# Altium project LM-002-D.PrjPcb
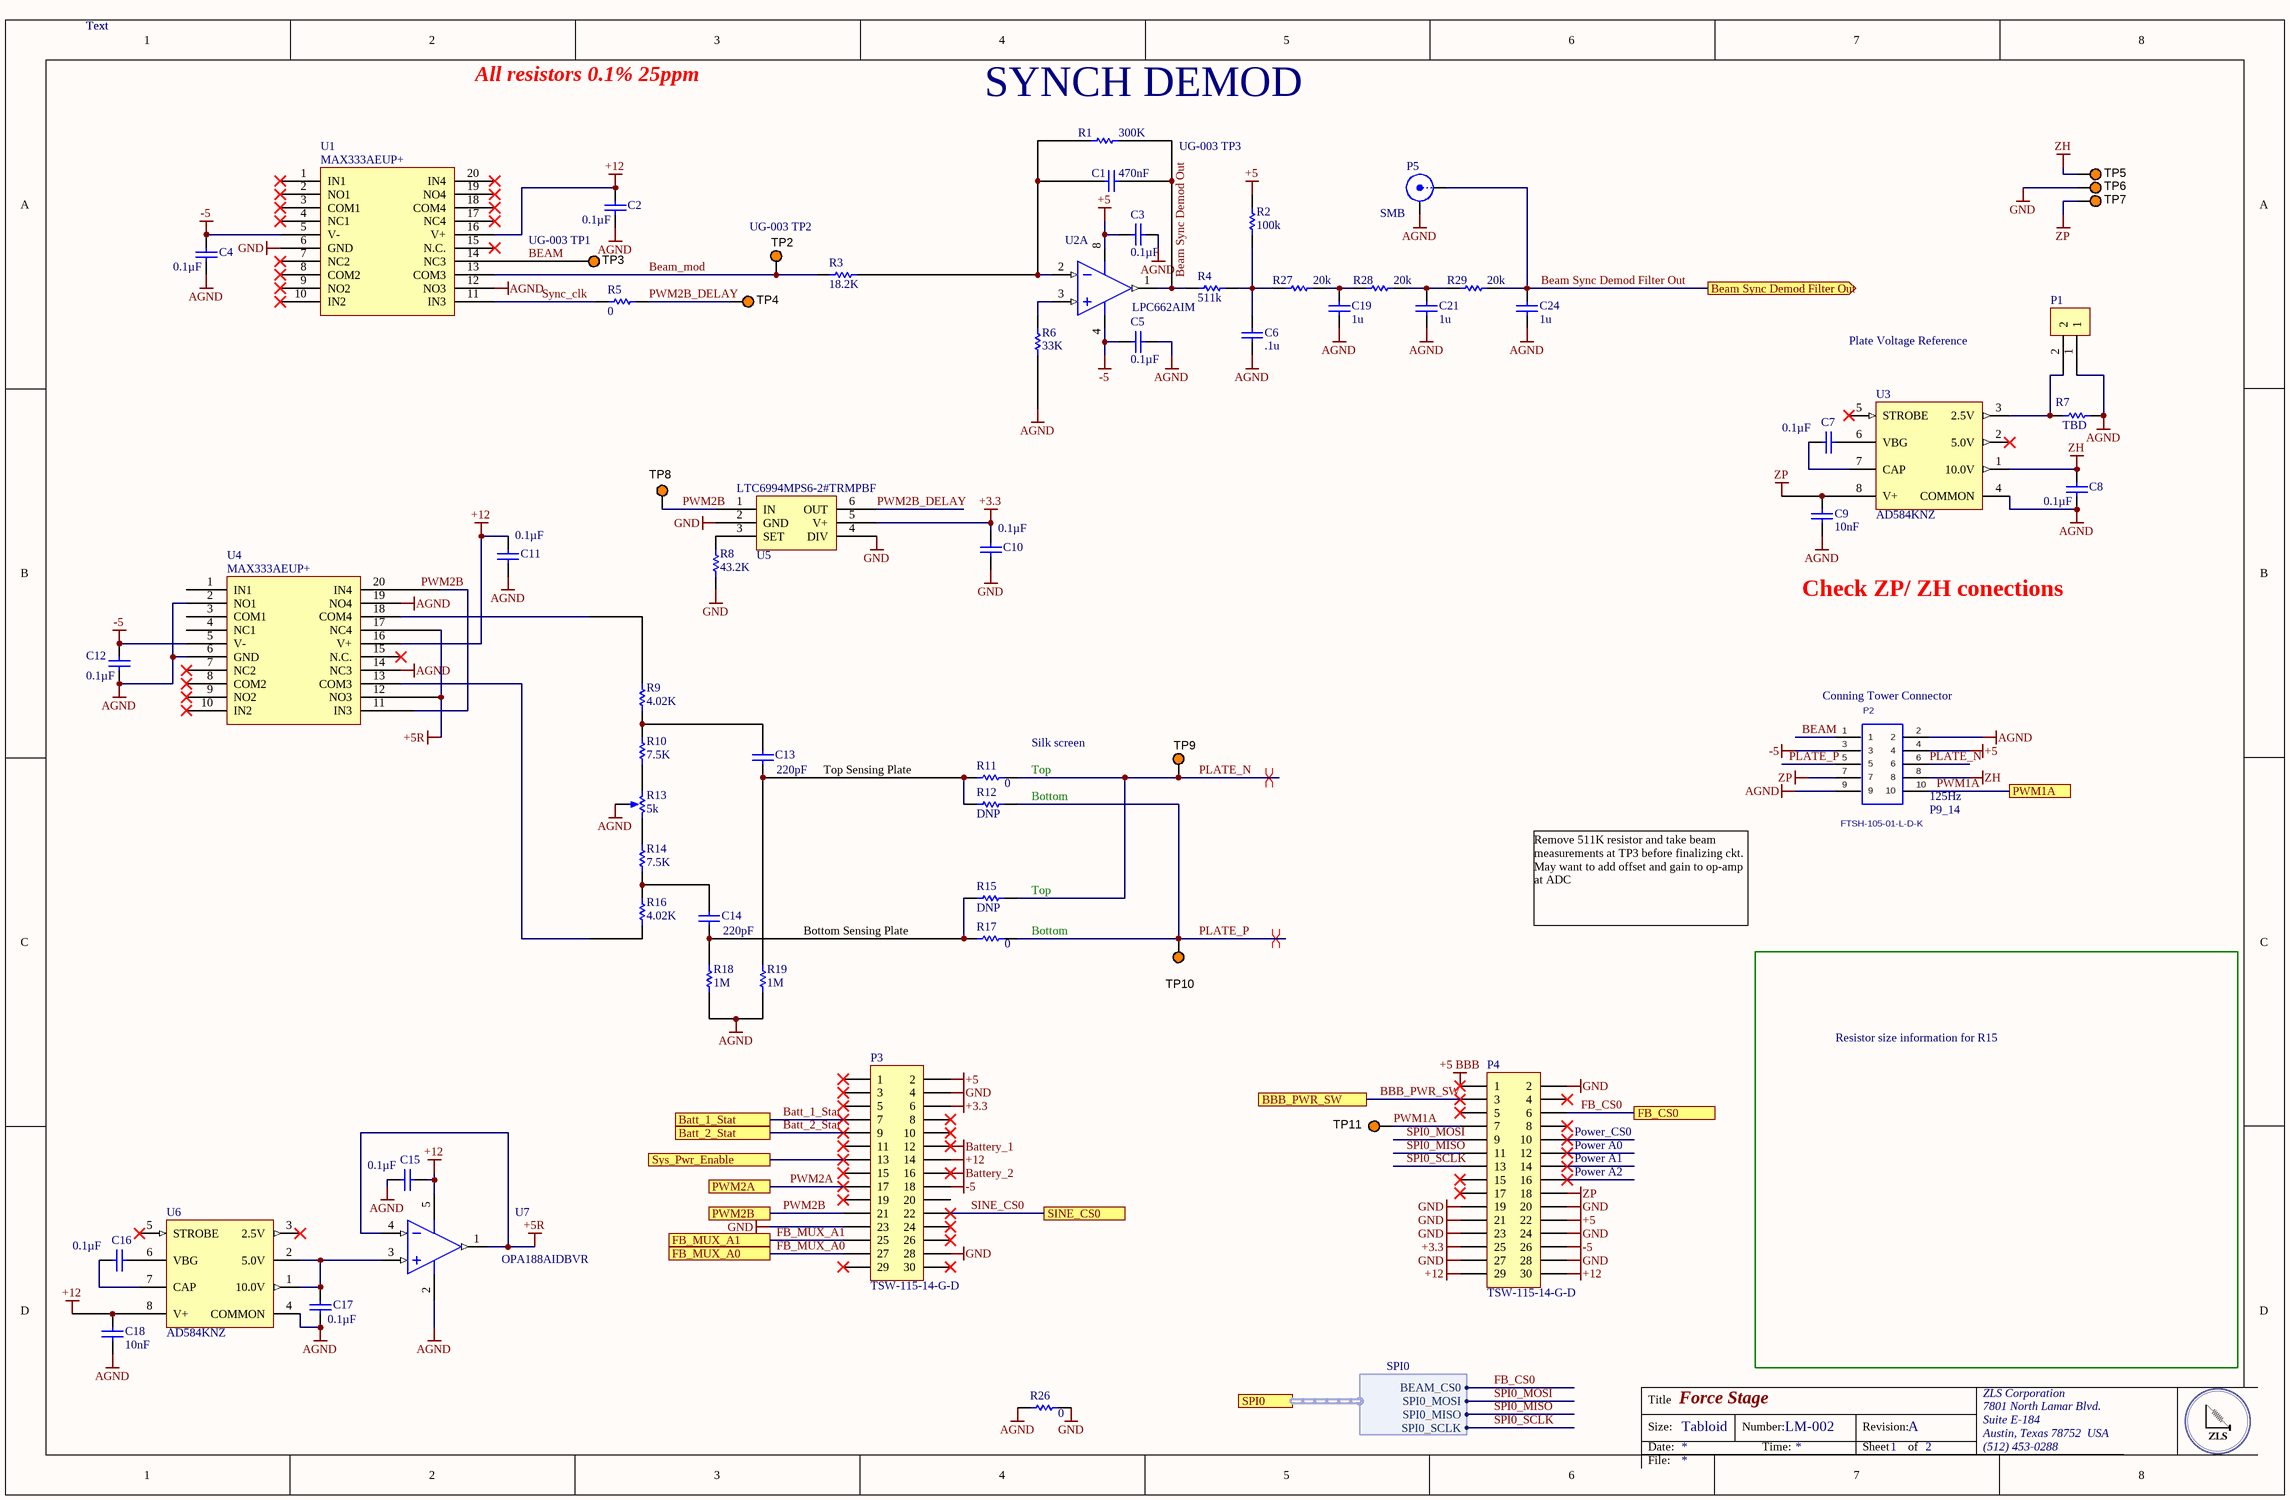
[diagram p0: Sheet1.SchDoc]
2 sheets, 82 parts. Net scope: flat (ports and power ports of the same name join across sheets).
Board file: PCB1.PcbDoc
Sheets:
  Sheet1.SchDoc
  Sheet2.SchDoc

## Sheet Sheet1.SchDoc: Force Stage
size Tabloid; DocumentNumber: LM-002; Revision: A; SheetNumber: 1; SheetTotal: 2; DocumentName: LM-002; ProjectName: LM-002

### Parts
C1  470nF  [CAPC0805(2012)75_L]
C2  Capacitance: 0.1µF  [CAPC0805(2012)145_N]  (hidden comment: CAP CER 0.1UF 25V X7R 0805)
C3  Capacitance: 0.1µF  [CAPC0805(2012)145_N]  (hidden comment: CAP CER 0.1UF 25V X7R 0805)
C4  Capacitance: 0.1µF  [CAPC0805(2012)145_N]  (hidden comment: CAP CER 0.1UF 25V X7R 0805)
C5  Capacitance: 0.1µF  [CAPC0805(2012)145_N]  (hidden comment: CAP CER 0.1UF 25V X7R 0805)
C6  .1u  [CAPC0805(2012)75_L]
C7  Capacitance: 0.1µF  [CAPC0805(2012)145_N]  (hidden comment: CAP CER 0.1UF 25V X7R 0805)
C8  Capacitance: 0.1µF  [CAPC0805(2012)145_N]  (hidden comment: CAP CER 0.1UF 25V X7R 0805)
C9  Capacitance: 10nF  [CAPC0805(2012)145_N]  (hidden comment: Multilayer Ceramic Capacitors MLCC - SMD/SMT 0.01uF 50volts 10% X7R)
C10  Capacitance: 0.1µF  [CAPC0805(2012)145_N]  (hidden comment: CAP CER 0.1UF 25V X7R 0805)
C11  Capacitance: 0.1µF  [CAPC0805(2012)145_N]  (hidden comment: CAP CER 0.1UF 25V X7R 0805)
C12  Capacitance: 0.1µF  [CAPC0805(2012)145_N]  (hidden comment: CAP CER 0.1UF 25V X7R 0805)
C13  Capacitance: 220pF  [CAPC0805(2012)155_L]  (hidden comment: CAP CER 1UF 25V X7R 0805)
C14  Capacitance: 220pF  [CAPC0805(2012)155_L]  (hidden comment: CAP CER 1UF 25V X7R 0805)
C15  Capacitance: 0.1µF  [CAPC0805(2012)145_N]  (hidden comment: CAP CER 0.1UF 25V X7R 0805)
C16  Capacitance: 0.1µF  [CAPC0805(2012)145_N]  (hidden comment: CAP CER 0.1UF 25V X7R 0805)
C17  Capacitance: 0.1µF  [CAPC0805(2012)145_N]  (hidden comment: CAP CER 0.1UF 25V X7R 0805)
C18  Capacitance: 10nF  [CAPC0805(2012)145_N]  (hidden comment: Multilayer Ceramic Capacitors MLCC - SMD/SMT 0.01uF 50volts 10% X7R)
C19  1u  [CAPC0805(2012)75_L]
C21  1u  [CAPC0805(2012)75_L]
C24  1u  [CAPC0805(2012)75_L]
P1  SSW-102-02-G-S-RA  [SSW-102-02-G-S-RA]  (value not drawn)
P2  FTSH-105-01-L-D-K  [FTSH-105-01-XXX-D-K]
P3  TSW-115-14-G-D  [TSW-115-14-G-D]
P4  TSW-115-14-G-D  [TSW-115-14-G-D]
P5  SMB  [RSP-122811-02]
R1  300K  [RESC0805(2012)_L]
R2  100k  [RESC0805(2012)_L]
R3  18.2K  [RESC0805(2012)_L]
R4  511k  [RESC0805(2012)_L]
R5  0  [RESC0805(2012)_L]
R6  33K  [RESC0805(2012)_L]
R7  TBD  [VH102K]
R8  43.2K  [RESC0805(2012)_L]
R9  4.02K  [RESC0805(2012)_L]
R10  7.5K  [RESC0805(2012)_L]
R11  0  [RESC0805(2012)_L]
R12  DNP  [RESC0805(2012)_L]
R13  Resistance (Ohms): 5k  [Trimmer 2.54]  (hidden comment: TRIMMER 5K OHM 0.25W PC PIN)
R14  7.5K  [RESC0805(2012)_L]
R15  DNP  [RESC0805(2012)_L]
R16  4.02K  [RESC0805(2012)_L]
R17  0  [RESC0805(2012)_L]
R18  1M  [RESC0805(2012)_L]
R19  1M  [RESC0805(2012)_L]
R26  0  [RESC0805(2012)_L]
R27  20k  [RESC0805(2012)_L]
R28  20k  [RESC0805(2012)_L]
R29  20k  [RESC0805(2012)_L]
TP2  5003  [KSTN-5003]  (value not drawn)
TP3  5003  [KSTN-5003]  (value not drawn)
TP4  5003  [KSTN-5003]  (value not drawn)
TP5  5003  [KSTN-5003]  (value not drawn)
TP6  5003  [KSTN-5003]  (value not drawn)
TP7  5003  [KSTN-5003]  (value not drawn)
TP8  5003  [KSTN-5003]  (value not drawn)
TP9  5003  [KSTN-5003]  (value not drawn)
TP10  5003  [KSTN-5003]  (value not drawn)
TP11  5003  [KSTN-5003]  (value not drawn)
U1  MAX333AEUP+  [TSOP65P640X90-20N]
U2  LPC662AIM  [D0008A_M]  (part A of 2)
U3  AD584KNZ  [ADI-N-8]
U4  MAX333AEUP+  [TSOP65P640X90-20N]
U5  LTC6994MPS6-2#TRMPBF  [LTC6994MPS6-2#TRMPBF]
U6  AD584KNZ  [ADI-N-8]
U7  OPA188AIDBVR  [DBV0005A_M]

### Ports
Batt_1_Stat, Batt_2_Stat, BBB_PWR_SW, Beam Sync Demod Filter Out (out), FB_CS0, FB_MUX_A0, FB_MUX_A1, PWM1A, PWM2A, PWM2B, SINE_CS0, SPI0 (harness SPI0), Sys_Pwr_Enable

### Harnesses
SPI0: BEAM_CS0, SPI0_MOSI, SPI0_MISO, SPI0_SCLK

### Nets
+3.3: C10.1 P3.6 P4.25 U5.5(V+)
+5: C3.1 P2.4 P3.2 P4.22 R2.2 U2.8(V+)
+5 BBB: P4.1
+5R: U4.12(NO3) U4.17(NC4) U7.1(OUT) U7.4(IN-)
+12: C2.1 C11.1 C15.2 C18.1 P3.14 P4.29 P4.30 U1.16(V+) U4.16(V+) U6.8(V+) U7.5(V+)
-5: C4.1 C5.1 C12.1 P2.3 P3.18 P4.26 U1.5(V-) U2.4(V-) U4.5(V-)
AGND: C2.2 C3.2 C4.2 C5.2 C6.1 C8.2 C9.2 C11.2 C12.2 C15.1 C17.2 C18.2 C19.1 C21.1 C24.1 P1.1 P2.2 P2.9 P5.2(Y) R6.1 R7.2 R13.2(b) R18.1 R19.1 R26.2 U1.12(NO3) U3.4(COMMON) U4.2(NO1) U4.6(GND) U4.14(NC3) U4.19(NO4) U6.4(COMMON) U7.2(V-)
Battery_1: P3.12
Battery_2: P3.16
GND: C10.2 P3.4 P3.23 P3.28 P4.2 P4.19 P4.20 P4.21 P4.23 P4.24 P4.27 P4.28 R8.2 R26.1 TP6.1 U1.6(GND) U5.2(GND) U5.4(DIV)
ZH: C8.1 P2.8 TP5.1 U3.1(10.0V)
ZP: C9.1 P2.7 P4.18 TP7.1 U3.8(V+)
Batt_1_Stat: P3.7 ; port Batt_1_Stat
Batt_2_Stat: P3.9 ; port Batt_2_Stat
BBB_PWR_SW: P4.3 ; port BBB_PWR_SW
BEAM: P2.1 TP3.1 U1.14(NC3)
Beam Sync Demod Filter Out: C24.2 P5.1(X) R29.1 ; port Beam Sync Demod Filter Out
Beam Sync Demod Out: C1.2 R1.1 R4.2 U2.1(OUTA)
Beam_mod: R3.2 TP2.1 U1.13(COM3)
FB_CS0: P4.6 ; port FB_CS0, port SPI0.BEAM_CS0
FB_MUX_A0: P3.27 ; port FB_MUX_A0
FB_MUX_A1: P3.25 ; port FB_MUX_A1
PLATE_N: P2.6 R11.1 R15.1 TP9.1
PLATE_P: P2.5 R12.1 R17.1 TP10.1
PWM1A: P2.10 P4.7 TP11.1 ; port PWM1A
PWM2A: P3.17 ; port PWM2A
PWM2B: P3.21 TP8.1 U4.11(IN3) U4.20(IN4) U5.1(IN) ; port PWM2B
PWM2B_DELAY: R5.1 TP4.1 U5.6(OUT)
SINE_CS0: P3.22 ; port SINE_CS0
SPI0_MISO: P4.11 ; port SPI0.SPI0_MISO
SPI0_MOSI: P4.9 ; port SPI0.SPI0_MOSI
SPI0_SCLK: P4.13 ; port SPI0.SPI0_SCLK
Sync_clk: R5.2 U1.11(IN3)
NetC1_1: C1.1 R1.2 R3.1 U2.2(INA-)
NetC6_2: C6.2 R2.1 R4.1 R27.2
NetC7_1: C7.1 U3.7(CAP)
NetC7_2: C7.2 U3.6(VBG)
NetC13_1: C13.1 R11.2 R12.2 R19.2
NetC13_2: C13.2 R9.1 R10.2
NetC14_1: C14.1 R15.2 R17.2 R18.2
NetC14_2: C14.2 R14.1 R16.2
NetC16_1: C16.1 U6.7(CAP)
NetC16_2: C16.2 U6.6(VBG)
NetC17_1: C17.1 U6.1(10.0V) U6.2(5.0V) U7.3(IN+)
NetC19_2: C19.2 R27.1 R28.2
NetC21_2: C21.2 R28.1 R29.2
NetP1_2: P1.2 R7.1 U3.3(2.5V)
NetP3_13: P3.13 ; port Sys_Pwr_Enable
NetR6_2: R6.2 U2.3(INA+)
NetR8_1: R8.1 U5.3(SET)
NetR9_2: R9.2 U4.18(COM4)
NetR10_1: R10.1 R13.1(a)
NetR13_3: R13.3(c) R14.2
NetR16_1: R16.1 U4.13(COM3)

Not connected (* = marked no-connect by the designer): P3 1* 3* 5* 8* 10* 11* 15* 19* 20 24* 26* 29* 30*; P4 4* 5* 8* 10* 12* 14* 15* 16* 17*; U1 1(IN1)* 2(NO1)* 3(COM1)* 4(NC1)* 7(NC2)* 8(COM2)* 9(NO2)* 10(IN2)* 15(N.C.)* 17(NC4)* 18(COM4)* 19(NO4)* 20(IN4)*; U3 2(5.0V)* 5(STROBE)*; U4 1(IN1) 3(COM1) 4(NC1) 7(NC2)* 8(COM2)* 9(NO2)* 10(IN2)* 15(N.C.)*; U6 3(2.5V)* 5(STROBE)*

### Layout directives
differential pair: PLATE_N, PLATE_P

### Notes on the sheet
- Text
- All resistors 0.1% 25ppm
- (near R1) SYNCH DEMOD
- UG-003 TP3
- (near TP3) UG-003 TP1
- (near TP2) UG-003 TP2
- Plate Voltage Reference
- Check ZP/ ZH conections
- (near P2) Conning Tower Connector
- Top Sensing Plate
- Silk screen
- Top
- Bottom
- (near P2) 125Hz
- (near P2) P9_14
- (near R15) Top
- Bottom Sensing Plate
- Remove 511K resistor and take beam measurements at TP3 before finalizing ckt.
  May want to add offset and gain to op-amp at ADC
- Resistor size information for R15
- (near P4) Power_CS0
- (near P4) Power A0
- (near P4) Power A1
- (near P4) Power A2
- Title
- Size:
- Date:
- Tabloid
- Number:
- Time:
- Revision:
- Sheet
- of
- ZLS Corporation
- 7801 North Lamar Blvd.
- Suite E-184
- Austin, Texas 78752  USA
- (512) 453-0288
- File:

### Library data of the parts
C1 = CMP-1036-02117-1: CAP CER 0.47UF 25V X7R 0805; Manufacturer: Murata Electronics North America; Manufacturer Part Number: GRM219R71E474KA88D; Tolerance: ±10%; Supplier 1: Digi-Key; Supplier Part Number 1: 490-11584-1-ND; RoHS: RoHS Compliant; Category: Capacitors; Stock 1: 410; Pricing 1: 1=0.38, 10=0.262, 100=0.1573, 500=0.118, 1000=0.09964 (USD); Packaging: Cut Tape (CT); Part Status: Active; Voltage - Rated: 25V; Temperature Coefficient: X7R; Operating Temperature: -55°C ~ 125°C; Features: -; Ratings: -; Applications: General Purpose; Mounting Type: Surface Mount, MLCC; Package / Case: 0805 (2012 Metric); Size / Dimension: 0.079" L x 0.049" W (2.00mm x 1.25mm); Height - Seated (Max): -; Thickness (Max): 0.037" (0.95mm); Lead Spacing: -; Lead Style: -; ComponentLink1URL: https://www.murata.com/~/media/webrenewal/support/library/catalog/products/capacitor/mlcc/c02e.ashx?la=en-us; ComponentLink1Description: https://www.murata.com/~/media/webrenewal/support/library/catalog/products/capacitor/mlcc/c02e.ashx?la=en-us
C2-C5 C7 C8 C10-C12 C15-C17 = CMP-1036-04795-1: Manufacturer: Murata Electronics North America; Manufacturer Part Number: GRM21BR71E104KA01L; Tolerance: ±10%; Supplier 1: Digi-Key; Supplier Part Number 1: 490-1673-6-ND; RoHS: RoHS Compliant; Category: Capacitors; Stock 1: 891652; Pricing 1: 1=0.2, 10=0.145, 100=0.0683, 500=0.04788, 1000=0.03964 (USD); Packaging: Digi-Reel®; Part Status: Active; Voltage - Rated: 25V; Temperature Coefficient: X7R; Operating Temperature: -55°C ~ 125°C; Features: -; Ratings: -; Applications: General Purpose; Mounting Type: Surface Mount, MLCC; Package / Case: 0805 (2012 Metric); Size / Dimension: 0.079" L x 0.049" W (2.00mm x 1.25mm); Height - Seated (Max): -; Thickness (Max): 0.053" (1.35mm); Lead Spacing: -; Lead Style: -; ComponentLink1URL: http://www.murata.com/~/media/webrenewal/support/library/catalog/products/capacitor/mlcc/c02e.ashx; ComponentLink1Description: http://www.murata.com/~/media/webrenewal/support/library/catalog/products/capacitor/mlcc/c02e.ashx
C6 C19 C21 C24 = CMP-1036-02117-1: CAP CER 22UF 25V X5R 0805
C9 C18 = CMP-1036-04795-1: Manufacturer: Kemet; Manufacturer Part Number: C0805C103K5RACAUTO; Voltage Rating: 50V; Supplier 1: Digi-Key; Supplier Part Number 1: 399-6924-1-ND; Stock 1: 63236; Pricing 1: 1=0.12, 10=0.087, 100=0.041, 500=0.0287, 1000=0.0238 (USD); Mount: Surface Mount; Case/Package: 0805; Case Code (Metric): 2012; Case Code (Imperial): 0805; Dielectric Material: Ceramic; Contact Plating: Tin; Min Operating Temperature: -55°C; Max Operating Temperature: 125°C; Tolerance: 10%; Packaging: Tape and Reel; Package Quantity: 1; Voltage Rating (DC): 50V; Dielectric: X7R; Termination: SMD/SMT; Length: 2mm; Height: 0.78mm; Width: 0.049inch; Thickness: 0.035inch; Depth: 1.25mm; Radiation Hardening: No; REACH SVHC: No SVHC; ComponentLink1URL: https://datasheet.ciiva.com/22700/1693454-22700519.pdf; ComponentLink1Description: https://datasheet.ciiva.com/22700/1693454-22700519.pdf; ComponentLink2URL: https://datasheet.ciiva.com/7842/1693454-7842175.pdf; ComponentLink2Description: https://datasheet.ciiva.com/7842/1693454-7842175.pdf
C13 C14 = CMP-1036-04882-1: Manufacturer: Murata Electronics North America; Manufacturer Part Number: GRM21BR71E105KA99L; Tolerance: ±10%; Supplier 1: Digi-Key; Supplier Part Number 1: 490-6484-6-ND; RoHS: RoHS Compliant; Category: Capacitors; Stock 1: 295074; Pricing 1: 1=0.14, 10=0.099, 100=0.0468, 500=0.0328, 1000=0.02715 (USD); Packaging: Digi-Reel®; Part Status: Active; Voltage - Rated: 25V; Temperature Coefficient: X7R; Operating Temperature: -55°C ~ 125°C; Features: -; Ratings: -; Applications: General Purpose; Mounting Type: Surface Mount, MLCC; Package / Case: 0805 (2012 Metric); Size / Dimension: 0.079" L x 0.049" W (2.00mm x 1.25mm); Height - Seated (Max): -; Thickness (Max): 0.053" (1.35mm); Lead Spacing: -; Lead Style: -; ComponentLink1URL: http://www.murata.com/~/media/webrenewal/support/library/catalog/products/capacitor/mlcc/c02e.ashx; ComponentLink1Description: http://www.murata.com/~/media/webrenewal/support/library/catalog/products/capacitor/mlcc/c02e.ashx
P1 = SSW-102-02-G-S-RA: CONN RCPT .100" 2POS R/A SGL AU; Manufacturer: Samtec Inc.; Connector Type: Receptacle; Style: Board to Board or Cable; Number of Positions: 2; Number of Positions Loaded: All; Pitch - Mating: 0.100" (2.54mm); Material Flammability Rating: UL94 V-0; Current Rating: 5.7A per Contact; Supplier 1: Digi-Key; Supplier Part Number 1: SAM1225-02-ND; Manufacturer Part Number: SSW-102-02-G-S-RA; RoHS: RoHS Compliant; Category: Connectors, Interconnects; Stock 1: 304; Pricing 1: 1=1.8, 10=1.607, 100=1.3234, 500=1.04614, 1000=0.89804, 5000=0.81926, 10000=0.78775 (USD); Packaging: Bulk; Part Status: Active; Contact Type: Forked; Row Spacing - Mating: -; Mounting Type: Through Hole, Right Angle; Termination: Solder; Fastening Type: Push-Pull; Contact Finish - Mating: Gold; Contact Finish Thickness - Mating: 20.0µin (0.51µm); Insulation Color: Black; Insulation Height: 0.095" (2.41mm); Contact Length - Post: 0.100" (2.54mm); Operating Temperature: -55°C ~ 125°C; Contact Finish - Post: Gold; Mated Stacking Heights: -; Ingress Protection: -; Features: -; Voltage Rating: -; Applications: -; Insulation Material: Liquid Crystal Polymer (LCP); Contact Shape: Square; Contact Material: Phosphor Bronze; Contact Finish Thickness - Post: 3.00µin (0.076µm); ComponentLink1URL: http://suddendocs.samtec.com/prints/ssw-1xx-xx-xxx-x-xx-xxx-xx-mkt.pdf; ComponentLink1Description: http://suddendocs.samtec.com/prints/ssw-1xx-xx-xxx-x-xx-xxx-xx-mkt.pdf
P2 = FTSH-105-01-XXX-D-K: TERMINAL STRIP, .050"(1.27mm) PITCH, 10 PINS, KEYING OPTION.; Manufacturer: Samtec Inc.; Connector Type: Header, Cuttable; Pitch - Mating: 0.050" (1.27mm); Number of Positions: 10; Number of Positions Loaded: All; Style: Board to Board or Cable; Shrouding: Unshrouded; Contact Length - Mating: 0.120" (3.05mm); Contact Length - Post: 0.090" (2.29mm); Overall Contact Length: 0.309" (7.86mm); Material Flammability Rating: UL94 V-0; Current Rating: 3.4A per Contact; Supplier 1: Digi-Key; Supplier Part Number 1: SAM8798-ND; Manufacturer Part Number: FTSH-105-01-L-D-K; RoHS: RoHS Compliant; Category: Connectors, Interconnects; Stock 1: 8521; Pricing 1: 1=2.98, 92=2.49902, 184=2.38, 552=2.02301, 1012=1.7255, 5060=1.547 (USD); Packaging: Tube; Part Status: Active; Contact Type: Male Pin; Number of Rows: 2; Row Spacing - Mating: 0.050" (1.27mm); Mounting Type: Through Hole; Termination: Solder; Fastening Type: Push-Pull; Insulation Height: 0.099" (2.51mm); Contact Shape: Square; Contact Finish - Mating: Gold; Contact Finish Thickness - Mating: 10.0µin (0.25µm); Contact Finish - Post: Tin; Contact Material: Phosphor Bronze; Insulation Material: Liquid Crystal Polymer (LCP); Features: Keying Shroud; Operating Temperature: -55°C ~ 125°C; Ingress Protection: -; Insulation Color: Black; Voltage Rating: -; Mated Stacking Heights: -; Contact Finish Thickness - Post: -; Applications: -; ComponentLink1URL: http://suddendocs.samtec.com/prints/ftsh-1xx-xx-xx-d-xx-xx-mkt.pdf; ComponentLink1Description: http://suddendocs.samtec.com/prints/ftsh-1xx-xx-xx-d-xx-xx-mkt.pdf
P3 P4 = Header 15X2: Header, 15-Pin, Dual row; Manufacturer: Samtec Inc.; Pitch - Mating: 0.100" (2.54mm); Number of Positions: 30; Number of Positions Loaded: All; Style: Board to Board or Cable; Shrouding: Unshrouded; Contact Length - Mating: 0.320" (8.13mm); Contact Length - Post: 0.110" (2.79mm); Overall Contact Length: 0.530" (13.46mm); Material Flammability Rating: UL94 V-0; Supplier 1: Digi-Key; Supplier Part Number 1: SAM1052-15-ND; Manufacturer Part Number: TSW-115-14-G-D; RoHS: RoHS Compliant; Category: Connectors, Interconnects; Stock 1: 0; Pricing 1: 1=3.69, 10=3.3, 100=2.7176, 500=2.1482, 1000=1.84409, 5000=1.68233, 10000=1.61763 (USD); Packaging: Bulk; Part Status: Active; Connector Type: Header; Contact Type: Male Pin; Number of Rows: 2; Row Spacing - Mating: 0.100" (2.54mm); Mounting Type: Through Hole; Termination: Solder; Fastening Type: Push-Pull; Insulation Height: 0.100" (2.54mm); Contact Shape: Square; Contact Finish - Mating: Gold; Contact Finish Thickness - Mating: 10.0µin (0.25µm); Contact Finish - Post: Gold; Contact Material: Phosphor Bronze; Insulation Material: Polybutylene Terephthalate (PBT); Features: -; Operating Temperature: -55°C ~ 125°C; Ingress Protection: -; Insulation Color: Black; Current Rating: -; Voltage Rating: -; Mated Stacking Heights: -; Contact Finish Thickness - Post: 3.00µin (0.076µm); Applications: -; ComponentLink1URL: http://suddendocs.samtec.com/prints/tsw-xxx-xx-xxx-x-xx-xxx-mkt.pdf; ComponentLink1Description: http://suddendocs.samtec.com/prints/tsw-xxx-xx-xxx-x-xx-xxx-mkt.pdf
P5 = SMB: SMB Straight Connector; LatestRevisionDate: 17-Jul-2002; LatestRevisionNote: Re-released for DXP Platform.; Publisher: Altium Limited
R1 R27-R29 = CMP-1013-00215-1: RES SMD 300K OHM 1% 1/8W 0805; Manufacturer: Vishay Dale; Manufacturer Part Number: CRCW0805300KFKEAHP; Power (Watts): 0.5W, 1/2W; Temperature Coefficient: ±100ppm/°C; Supplier 1: Digi-Key; Supplier Part Number 1: 541-300KTCT-ND; RoHS: RoHS Compliant; Category: Resistors; Stock 1: 3851; Pricing 1: 1=0.28, 10=0.233, 100=0.0911, 1000=0.03812, 2500=0.03494 (USD); Packaging: Cut Tape (CT); Part Status: Active; Tolerance: ±1%; Composition: Thick Film; Features: Automotive AEC-Q200, Pulse Withstanding; Operating Temperature: -55°C ~ 155°C; Package / Case: 0805 (2012 Metric); Supplier Device Package: 0805; Size / Dimension: 0.079" L x 0.049" W (2.00mm x 1.25mm); Height - Seated (Max): 0.020" (0.50mm); Failure Rate: -; ComponentLink1URL: http://www.vishay.com/docs/20043/crcwhpe3.pdf; ComponentLink1Description: http://www.vishay.com/docs/20043/crcwhpe3.pdf
R2 = CMP-1013-00215-1: RES SMD 499K OHM 0.1% 1/8W 0805; Manufacturer: Panasonic Electronic Components; Manufacturer Part Number: ERA-6AEB4993V; Power (Watts): 0.125W, 1/8W; Temperature Coefficient: ±25ppm/°C; Supplier 1: Digi-Key; Supplier Part Number 1: P499KDACT-ND; RoHS: RoHS Compliant; Category: Resistors; Stock 1: 125602; Pricing 1: 1=0.36, 10=0.302, 100=0.1182, 1000=0.04948, 2500=0.04536 (USD); Packaging: Cut Tape (CT); Part Status: Active; Tolerance: ±0.1%; Composition: Thin Film; Features: Automotive AEC-Q200; Operating Temperature: -55°C ~ 155°C; Package / Case: 0805 (2012 Metric); Supplier Device Package: 0805; Size / Dimension: 0.079" L x 0.049" W (2.00mm x 1.25mm); Height - Seated (Max): 0.024" (0.60mm); Failure Rate: -; ComponentLink1URL: https://industrial.panasonic.com/cdbs/www-data/pdf/RDM0000/AOA0000C307.pdf; ComponentLink1Description: https://industrial.panasonic.com/cdbs/www-data/pdf/RDM0000/AOA0000C307.pdf
R3 = CMP-1013-00215-1: RES SMD 18.2K OHM 1% 1/8W 0805; Manufacturer: Panasonic Electronic Components; Manufacturer Part Number: ERJ-6ENF1822V; Power (Watts): 0.125W, 1/8W; Temperature Coefficient: ±100ppm/°C; Supplier 1: Digi-Key; Supplier Part Number 1: P18.2KCCT-ND; RoHS: RoHS Compliant; Category: Resistors; Stock 1: 116820; Pricing 1: 1=0.1, 10=0.079, 100=0.0305, 1000=0.0134, 2500=0.01157 (USD); Packaging: Cut Tape (CT); Part Status: Active; Tolerance: ±1%; Composition: Thick Film; Features: Automotive AEC-Q200; Operating Temperature: -55°C ~ 155°C; Package / Case: 0805 (2012 Metric); Supplier Device Package: 0805; Size / Dimension: 0.079" L x 0.049" W (2.00mm x 1.25mm); Height - Seated (Max): 0.028" (0.70mm); Failure Rate: -; ComponentLink1URL: https://industrial.panasonic.com/cdbs/www-data/pdf/RDA0000/AOA0000C304.pdf; ComponentLink1Description: https://industrial.panasonic.com/cdbs/www-data/pdf/RDA0000/AOA0000C304.pdf
R4 = CMP-1013-00215-1: RES SMD 249K OHM 0.1% 1/8W 0805; Manufacturer: Panasonic Electronic Components; Manufacturer Part Number: ERA-6AEB2493V; Power (Watts): 0.125W, 1/8W; Temperature Coefficient: ±25ppm/°C; Supplier 1: Digi-Key; Supplier Part Number 1: P249KDACT-ND; RoHS: RoHS Compliant; Category: Resistors; Stock 1: 18568; Pricing 1: 1=0.36, 10=0.302, 100=0.1182, 1000=0.04948, 2500=0.04536 (USD); Packaging: Cut Tape (CT); Part Status: Active; Tolerance: ±0.1%; Composition: Thin Film; Features: Automotive AEC-Q200; Operating Temperature: -55°C ~ 155°C; Package / Case: 0805 (2012 Metric); Supplier Device Package: 0805; Size / Dimension: 0.079" L x 0.049" W (2.00mm x 1.25mm); Height - Seated (Max): 0.024" (0.60mm); Failure Rate: -; ComponentLink1URL: https://industrial.panasonic.com/cdbs/www-data/pdf/RDM0000/AOA0000C307.pdf; ComponentLink1Description: https://industrial.panasonic.com/cdbs/www-data/pdf/RDM0000/AOA0000C307.pdf
R5 R11 R12 R15 R17 R26 = CMP-1013-00215-1: RES SMD 0 OHM JUMPER 1/8W 0805; Manufacturer: Panasonic Electronic Components; Manufacturer Part Number: ERJ-6GEY0R00V; Power (Watts): 0.125W, 1/8W; Supplier 1: Digi-Key; Supplier Part Number 1: P0.0ACT-ND; RoHS: RoHS Compliant; Category: Resistors; Stock 1: 3414819; Pricing 1: 1=0.1, 10=0.074, 25=0.0532, 50=0.0406, 100=0.03, 250=0.02288, 500=0.0183, 1000=0.01347 (USD); Packaging: Cut Tape (CT); Part Status: Active; Tolerance: Jumper; Composition: Thick Film; Features: Automotive AEC-Q200; Temperature Coefficient: -; Operating Temperature: -55°C ~ 155°C; Package / Case: 0805 (2012 Metric); Supplier Device Package: 0805; Size / Dimension: 0.079" L x 0.049" W (2.00mm x 1.25mm); Height - Seated (Max): 0.028" (0.70mm); Failure Rate: -; ComponentLink1URL: http://industrial.panasonic.com/www-cgi/jvcr13pz.cgi?E+PZ+3+AOA0001+ERJ6GEY0R00V+7+WW; ComponentLink1Description: http://industrial.panasonic.com/www-cgi/jvcr13pz.cgi?E+PZ+3+AOA0001+ERJ6GEY0R00V+7+WW
R6 = CMP-1013-00215-1: RES SMD 33K OHM 1% 1/2W 0805; Manufacturer: Vishay Dale; Manufacturer Part Number: CRCW080533K0FKEAHP; Power (Watts): 0.5W, 1/2W; Temperature Coefficient: ±100ppm/°C; Supplier 1: Digi-Key; Supplier Part Number 1: 541-33.0KTCT-ND; RoHS: RoHS Compliant; Category: Resistors; Stock 1: 2026; Pricing 1: 1=0.28, 10=0.233, 100=0.0911, 1000=0.03812, 2500=0.03494 (USD); Packaging: Cut Tape (CT); Part Status: Active; Tolerance: ±1%; Composition: Thick Film; Features: Automotive AEC-Q200, Pulse Withstanding; Operating Temperature: -55°C ~ 155°C; Package / Case: 0805 (2012 Metric); Supplier Device Package: 0805; Size / Dimension: 0.079" L x 0.049" W (2.00mm x 1.25mm); Height - Seated (Max): 0.020" (0.50mm); Failure Rate: -; ComponentLink1URL: http://www.vishay.com/docs/20043/crcwhpe3.pdf; ComponentLink1Description: http://www.vishay.com/docs/20043/crcwhpe3.pdf
R7 = CMP-1013-00393-1
R8 = CMP-1013-00215-1: RES SMD 43.2K OHM 1% 1/8W 0805; Manufacturer: Vishay Dale; Manufacturer Part Number: CRCW080543K2FKEA; Power (Watts): 0.125W, 1/8W; Temperature Coefficient: ±100ppm/°C; Supplier 1: Digi-Key; Supplier Part Number 1: 541-43.2KCCT-ND; RoHS: RoHS Compliant; Category: Resistors; Stock 1: 68577; Pricing 1: 1=0.1, 10=0.055, 100=0.0223, 1000=0.01003, 2500=0.0087 (USD); Packaging: Cut Tape (CT); Part Status: Active; Tolerance: ±1%; Composition: Thick Film; Features: Automotive AEC-Q200; Operating Temperature: -55°C ~ 155°C; Package / Case: 0805 (2012 Metric); Supplier Device Package: 0805; Size / Dimension: 0.079" L x 0.049" W (2.00mm x 1.25mm); Height - Seated (Max): 0.020" (0.50mm); Failure Rate: -; ComponentLink1URL: http://www.vishay.com/docs/20035/dcrcwe3.pdf; ComponentLink1Description: http://www.vishay.com/docs/20035/dcrcwe3.pdf
R9 R16 = CMP-1013-00215-1: RES SMD 4.02K OHM 1% 1/8W 0805; Manufacturer: Vishay Dale; Manufacturer Part Number: CRCW08054K02FKEAHP; Power (Watts): 0.5W, 1/2W; Temperature Coefficient: ±100ppm/°C; Supplier 1: Digi-Key; Supplier Part Number 1: 541-4.02KTCT-ND; RoHS: RoHS Compliant; Category: Resistors; Stock 1: 2935; Pricing 1: 1=0.28, 10=0.233, 100=0.0911, 1000=0.03812, 2500=0.03494 (USD); Packaging: Cut Tape (CT); Part Status: Active; Tolerance: ±1%; Composition: Thick Film; Features: Automotive AEC-Q200, Pulse Withstanding; Operating Temperature: -55°C ~ 155°C; Package / Case: 0805 (2012 Metric); Supplier Device Package: 0805; Size / Dimension: 0.079" L x 0.049" W (2.00mm x 1.25mm); Height - Seated (Max): 0.020" (0.50mm); Failure Rate: -; ComponentLink1URL: http://www.vishay.com/docs/20043/crcwhpe3.pdf; ComponentLink1Description: http://www.vishay.com/docs/20043/crcwhpe3.pdf
R10 R14 = CMP-1013-00215-1: RES SMD 7.5K OHM 1% 1/8W 0805; Manufacturer: Vishay Dale; Manufacturer Part Number: CRCW08057K50FKEA; Power (Watts): 0.125W, 1/8W; Temperature Coefficient: ±100ppm/°C; Supplier 1: Digi-Key; Supplier Part Number 1: 541-7.50KCCT-ND; RoHS: RoHS Compliant; Category: Resistors; Stock 1: 2093; Pricing 1: 1=0.1, 10=0.055, 100=0.0223, 1000=0.01003, 2500=0.0087 (USD); Packaging: Cut Tape (CT); Part Status: Active; Tolerance: ±1%; Composition: Thick Film; Features: Automotive AEC-Q200; Operating Temperature: -55°C ~ 155°C; Package / Case: 0805 (2012 Metric); Supplier Device Package: 0805; Size / Dimension: 0.079" L x 0.049" W (2.00mm x 1.25mm); Height - Seated (Max): 0.020" (0.50mm); Failure Rate: -; ComponentLink1URL: http://www.vishay.com/docs/20035/dcrcwe3.pdf; ComponentLink1Description: http://www.vishay.com/docs/20035/dcrcwe3.pdf
R13 = Trimmer: Manufacturer: Vishay Foil Resistors (Division of Vishay Precision Group); Manufacturer Part Number: Y00535K00000J0L; Power (Watts): 0.25W, 1/4W; Tolerance: ±5%; Temperature Coefficient: ±10ppm/°C; Number of Turns: 21; Adjustment Type: Side Adjustment; Resistive Material: Metal Foil; Supplier 1: Digi-Key; Supplier Part Number 1: 804-1020-ND; RoHS: RoHS Compliant; Category: Potentiometers, Variable Resistors; Stock 1: 679; Pricing 1: 1=34.42, 10=32.265, 25=26.5292, 50=22.944, 100=22.227, 250=20.793, 500=19.2156 (USD); Packaging: Bulk; Part Status: Active; Mounting Type: Through Hole; Termination Style: PC Pins; Size / Dimension: Rectangular - 0.250" x 0.175" Face x 0.250" L (6.35mm x 4.45mm x 6.35mm); ComponentLink1URL: http://www.vishaypg.com/docs/63053/1240.pdf; ComponentLink1Description: http://www.vishaypg.com/docs/63053/1240.pdf
R18 R19 = CMP-1013-00215-1: RES SMD 1M OHM 1% 1/8W 0805; Manufacturer: Vishay Dale; Manufacturer Part Number: RCV08051M00FKEA; Power (Watts): 0.125W, 1/8W; Temperature Coefficient: ±100ppm/°C; Supplier 1: Digi-Key; Supplier Part Number 1: BC2810CT-ND; RoHS: RoHS Compliant; Category: Resistors; Stock 1: 15942; Pricing 1: 1=0.31, 10=0.266, 100=0.1041, 1000=0.04356, 2500=0.03993 (USD); Packaging: Cut Tape (CT); Part Status: Active; Tolerance: ±1%; Composition: Thick Film; Features: High Voltage; Operating Temperature: -55°C ~ 155°C; Package / Case: 0805 (2012 Metric); Supplier Device Package: 0805; Size / Dimension: 0.079" L x 0.049" W (2.00mm x 1.25mm); Height - Seated (Max): 0.020" (0.50mm); Failure Rate: -; ComponentLink1URL: http://www.vishay.com/docs/20054/rcve3.pdf; ComponentLink1Description: http://www.vishay.com/docs/20054/rcve3.pdf
TP2-TP11 = CMP-1672-00009-1: Test Point, Orange, 1-Pin THD, RoHS; Peak Reverse Current: 600 uA; Forward Current: 3 A; Max Surge Current: 80 A; Forward Voltage: 1.08 V; Max Operating Temperature: 150 degC; PackageReference: 5003; Pins: 2; ComponentLink2URL: http://keyelco.com/userAssets/file/M65p56.pdf; PackageDescription: 1-Pin Through Hole Device, Dia 2.54 mm; Weight: 0.01 lb; Diameter: 5.3 mm; Mount: Through Hole; Package Quantity: 500; Packaging: Bulk; Min Operating Temperature: -65 degC; ComponentLink1Description: Manufacturer URL; Height: 0.25 inch; ComponentLink1URL: http://www.keyelco.com/; ComponentLink2Description: Datasheet; Width: 0.25 inch; REACH SVHC: No SVHC; RoHSCompliant: true; Radiation Hardening: No; Length: 9.5 mm; DatasheetVersion: Jun-15
U1 U4 = MAX333CWP+: IC SWITCH QUAD SPDT 20TSSOP; Manufacturer: Maxim Integrated; Multiplexer/Demultiplexer Circuit: 2:1; On-State Resistance (Max): 45 Ohm; Channel-to-Channel Matching (&Delta;Ron): 2 Ohm (Max); Voltage - Supply, Single (V+): 10 V ~ 30 V; Voltage - Supply, Dual (V±): ±4.5 V ~ 20 V; Switch Time (Ton, Toff) (Max): 175ns, 145ns; Charge Injection: 2pC; Channel Capacitance (CS(off), CD(off)): 5pF; Current - Leakage (IS(off)) (Max): 250pA; Crosstalk: -78dB @ 1MHz; Supplier 1: Digi-Key; Supplier Part Number 1: MAX333AEUP+-ND; Manufacturer Part Number: MAX333AEUP+; RoHS: RoHS Compliant; Category: Integrated Circuits (ICs); Stock 1: 1328; Pricing 1: 1=6.77, 10=6.432, 25=6, 50=5.8942 (USD); Packaging: Tube; Part Status: Active; Switch Circuit: SPDT; -3db Bandwidth: -; Operating Temperature: -40°C ~ 85°C (TA); Package / Case: 20-TSSOP (0.173", 4.40mm Width); Supplier Device Package: 20-TSSOP; Base Part Number: MAX333; ComponentLink1URL: https://pdfserv.maximintegrated.com/en/ds/MAX333A.pdf; ComponentLink1Description: https://pdfserv.maximintegrated.com/en/ds/MAX333A.pdf
U2 = CMP-0055-00867-3: Low Power CMOS Dual Operational Amplifier, 8-pin Narrow SOIC; Manufacturer: Texas Instruments; Manufacturer Part Number: LPC662AIM/NOPB; Amplifier Type: General Purpose; Output Type: Rail-to-Rail; Slew Rate: 0.11 V/µs; Current - Supply: 86µA; Voltage - Supply, Single/Dual (±): 4.75 V ~ 15.5 V, ±2.38 V ~ 7.75 V; Supplier 1: Digi-Key; Supplier Part Number 1: LPC662AIM/NOPB-ND; RoHS: RoHS Compliant; Category: Integrated Circuits (ICs); Stock 1: 319; Pricing 1: 1=3.4, 95=2.88905, 190=2.50379, 570=2.13144, 1045=1.7976 (USD); Packaging: Tube; Part Status: Active; Operating Temperature: -40°C ~ 85°C; Mounting Type: Surface Mount; Package / Case: 8-SOIC (0.154", 3.90mm Width); Supplier Device Package: 8-SOIC; Base Part Number: LPC662; ComponentLink1URL: http://www.ti.com/lit/ds/symlink/lpc662.pdf; ComponentLink1Description: http://www.ti.com/lit/ds/symlink/lpc662.pdf
U3 = CMP-0784-00054-1: Pin Programmable, Precision Voltage Reference, + 2.5 / + 5 / + 7.5 / + 10 Prog V Output, 4.5 to 30 V Supply, Commercial, 8-pin DIP (N-8), Tube; Manufacturer: Analog Devices Inc.; Reference Type: Series; Voltage - Output (Min/Fixed): 2.5V, 5V, 7.5V, 10V; Tolerance: ±0.1%; Temperature Coefficient: 15ppm/°C; Noise - 0.1Hz to 10Hz: 50µVp-p; Voltage - Input: 4.5 V ~ 30 V; Current - Supply: 1mA; Supplier 1: Digi-Key; Supplier Part Number 1: AD584KNZ-ND; Manufacturer Part Number: AD584KNZ; RoHS: RoHS Compliant; Category: Integrated Circuits (ICs); Stock 1: 387; Pricing 1: 1=17.64, 50=15.54, 100=13.692 (USD); Packaging: Tube; Part Status: Active; Output Type: Programmable; Noise - 10Hz to 10kHz: -; Operating Temperature: 0°C ~ 70°C (TA); Mounting Type: Through Hole; Package / Case: 8-DIP (0.300", 7.62mm); Supplier Device Package: 8-PDIP; Base Part Number: AD584; ComponentLink1URL: http://www.analog.com/media/en/technical-documentation/data-sheets/AD584.pdf; ComponentLink1Description: http://www.analog.com/media/en/technical-documentation/data-sheets/AD584.pdf
U5 = LTC6994MPS6-2#TRMPBF: IC DELAY BLOCK 8TAP PROG TSOT23; Manufacturer: Linear Technology/Analog Devices; Manufacturer Part Number: LTC6994CS6-2#TRMPBF; Function: Programmable; Available Total Delays: 1µs ~ 33.6s; Voltage - Supply: 2.25 V ~ 5.5 V; Supplier 1: Digi-Key; Supplier Part Number 1: LTC6994CS6-2#TRMPBFCT-ND; RoHS: RoHS Compliant; Category: Integrated Circuits (ICs); Stock 1: 1401; Pricing 1: 1=3.42, 25=3.0496, 100=1.9217, 250=1.76156 (USD); Packaging: Cut Tape (CT); Part Status: Active; Delay to 1st Tap: -; Operating Temperature: 0°C ~ 70°C; Mounting Type: Surface Mount; Package / Case: SOT-23-6 Thin, TSOT-23-6; Supplier Device Package: TSOT-23-6; Base Part Number: LTC6994; ComponentLink1URL: http://www.linear.com/docs/29725; ComponentLink1Description: http://www.linear.com/docs/29725
U6 = CMP-0784-00054-1: Pin Programmable, Precision Voltage Reference, + 2.5 / + 5 / + 7.5 / + 10 Prog V Output, 4.5 to 30 V Supply, Commercial, 8-pin DIP (N-8), Tube; Manufacturer: Analog Devices; Max V Supply (V): 30; Min V Supply (V): 4.5; Ref Out TC (ppm/C): 15; Vout: 2.5V, 5V, 7.5V, 10V; ComponentLink3URL: http:/www.analog.com/static/imported-files/packages/PKG_PDF/PDIP(N)/N_8.pdf; ComponentLink1URL: http://www.analog.com/en/index.html; PartNumber: AD584KNZ; ComponentLink1Description: Manufacturer URL; ComponentLink2Description: Datasheet; PackageDescription: 8-Pin Plastic Dual In-Line Package, Row spacing 7.62 mm, Pitch 2.54 mm; Operating Temp Range: 0 to 70 degC; DatasheetVersion: Rev. C; Code_JEDEC: MS-001; Packing: Tube; ComponentLink3Description: Package Specification; PackageReference: N-8; ComponentLink4Description: URL Link1; Mounting Technology: Through Hole; PackageVersion: 070606-A, 07/2006; ComponentLink4URL: Product URL:http://www.analog.com/en/special-linear-functions/voltage-references/ad584/products/product.html; ComponentLink2URL: http://www.analog.com/static/imported-files/data_sheets/AD584.pdf
U7 = CMP-0809-00005-2: Precision, Low Noise, Rail-to-Rail Output, Zero-Drift Operational Amplifier, 4 to 36 V, -40 to 125 degC, 5-pin SOT23 (DBV5), Green (RoHS & no Sb/Br); Manufacturer: Texas Instruments; Total Supply Voltage(Min)(+5V is 5, +/-5V is 10): 4; Offset Drift(Typ)(uV/C): 0.03; Rating: Catalog; SubFamily: Zero Drift Precision Amplifier; GBW(Typ)(MHz): 2; Slew Rate(Typ)(V/us): 0.8; Number of Channels: 1; CMRR(Min)(dB): 120; Iq per channel(Max)(mA): 0.51; Total Supply Voltage(Max)(+5V is 5, +/-5V is 10): 36; PartNumber: OPA188AIDBVR; ComponentLink2Description: Datasheet; ComponentLink2URL: http://www.ti.com/lit/ds/symlink/opa188.pdf; ComponentLink1Description: Manufacturer URL; Mounting Technology: Surface Mount; Eco-Plan: Green (RoHS & no Sb/Br); ComponentLink1URL: http://www.ti.com/; PackageVersion: 4073253-4/K, 03/2006; DatasheetVersion: SBOS642A; ComponentLink3Description: Package Specification; PackageReference: DBV0005A; ComponentLink3URL: http://www.ti.com/litv/pdf/mpds018i; PackageDescription: 5-Pin Plastic Small Outline, Body 1.6 x 2.9 mm, Pitch 0.95 mm; Code_JEDEC: MO-178

## Sheet Sheet2.SchDoc: Sense Stage
size Tabloid; DocumentNumber: LM-002; Revision: A; SheetNumber: 2; SheetTotal: 2; DocumentName: LM-002
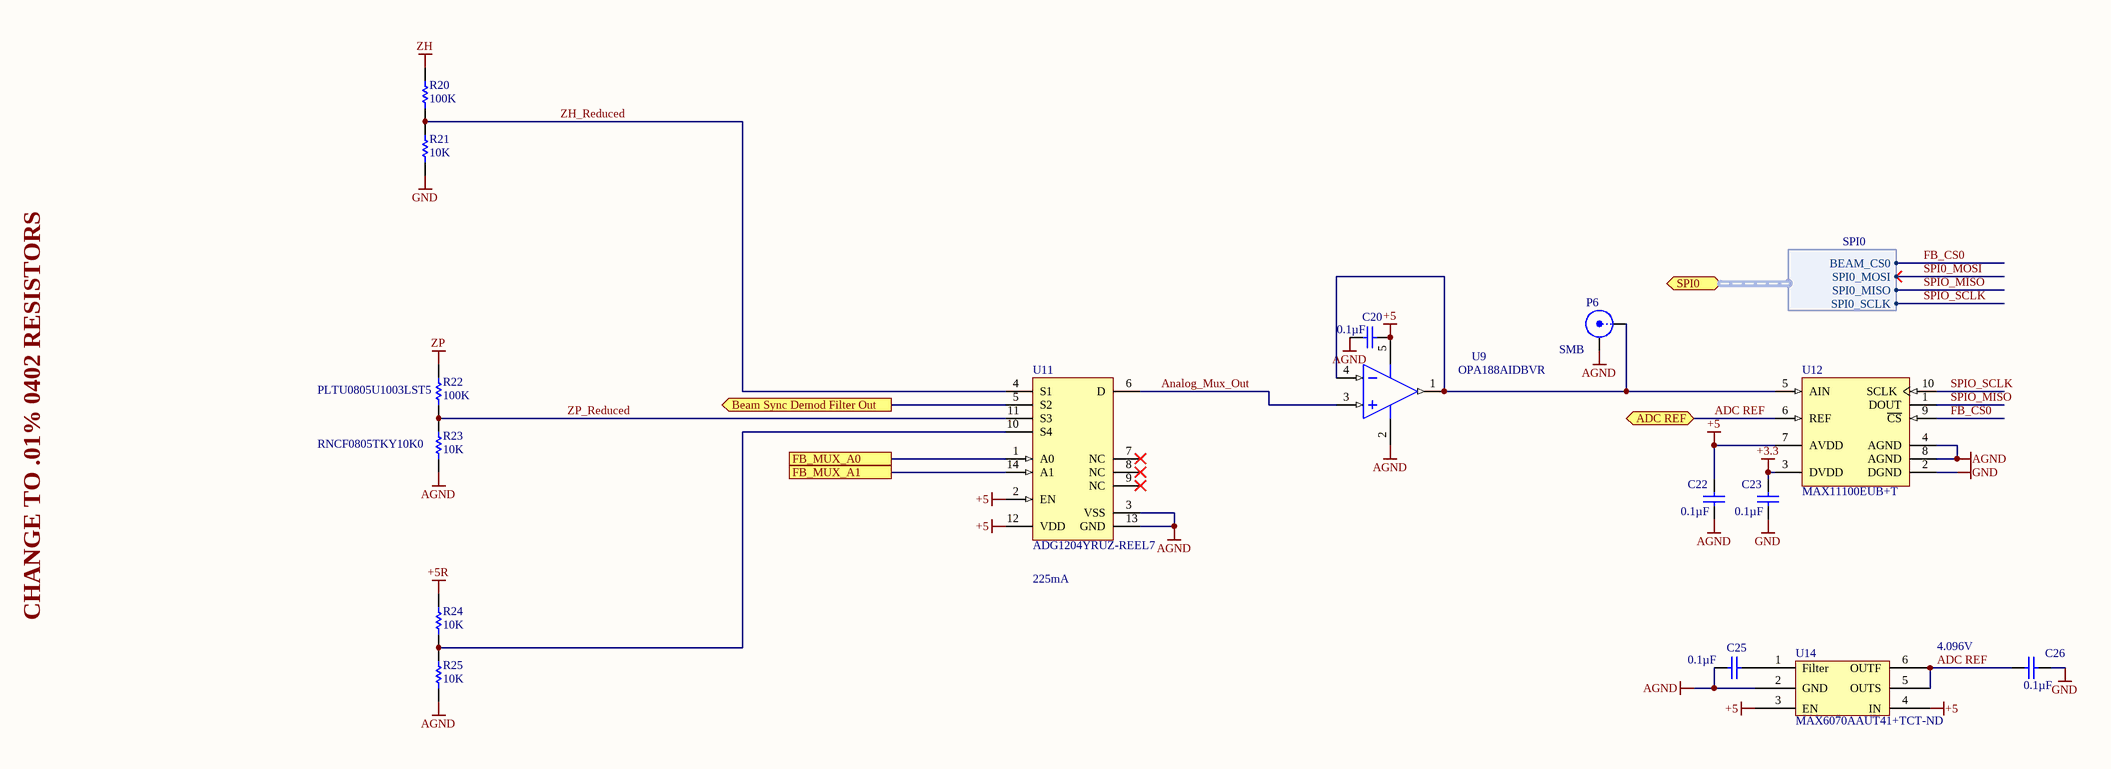
[diagram p1: Sheet2.SchDoc]

### Parts
C20  Capacitance: 0.1µF  [CAPC0805(2012)145_N]  (hidden comment: CAP CER 0.1UF 25V X7R 0805)
C22  Capacitance: 0.1µF  [CAPC0805(2012)145_N]  (hidden comment: CAP CER 0.1UF 25V X7R 0805)
C23  Capacitance: 0.1µF  [CAPC0805(2012)145_N]  (hidden comment: CAP CER 0.1UF 25V X7R 0805)
C25  Capacitance: 0.1µF  [CAPC0805(2012)145_N]  (hidden comment: CAP CER 0.1UF 25V X7R 0805)
C26  Capacitance: 0.1µF  [CAPC0805(2012)145_N]  (hidden comment: CAP CER 0.1UF 25V X7R 0805)
P6  SMB  [RSP-122811-02]
R20  100K  [RESC0805(2012)_L]
R21  10K  [RESC0805(2012)_L]
R22  100K  [RESC0805(2012)_L]
R23  10K  [RESC0805(2012)_L]
R24  10K  [RESC0805(2012)_L]
R25  10K  [RESC0805(2012)_L]
U9  OPA188AIDBVR  [DBV0005A_M]
U11  ADG1204YRUZ-REEL7  [ADI-RU-14_L]
U12  MAX11100EUB+T  [U10+2_L]
U14  Supplier Part Number 1: MAX6070AAUT41+TCT-ND  [SOT95P280X445-6N]  (hidden comment: MAX6070AAUT41+T)

### Ports
ADC REF, Beam Sync Demod Filter Out (out), FB_MUX_A0, FB_MUX_A1, SPI0 (harness SPI0)

### Harnesses
SPI0: BEAM_CS0, SPI0_MOSI, SPI0_MISO, SPI0_SCLK

### Nets
+3.3: C23.1 U12.3(DVDD)
+5: C20.2 C22.1 U9.5(V+) U11.2(EN) U11.12(VDD) U12.7(AVDD) U14.3(EN) U14.4(IN)
+5R: R24.2
AGND: C20.1 C22.2 C25.1 P6.2(Y) R23.1 R25.1 U9.2(V-) U11.3(VSS) U11.13(GND) U12.4(AGND) U12.8(AGND) U14.2(GND)
GND: C23.2 C26.2 R21.1 U12.2(DGND)
ZH: R20.2
ZP: R22.2
ADC REF: C26.1 U12.6(REF) U14.5(OUTS) U14.6(OUTF) ; port ADC REF
Analog_Mux_Out: U9.3(IN+) U11.6(D)
Beam Sync Demod Filter Out: U11.5(S2) ; port Beam Sync Demod Filter Out
FB_CS0: U12.9(~{CS}) ; port SPI0.BEAM_CS0
FB_MUX_A0: U11.1(A0) ; port FB_MUX_A0
FB_MUX_A1: U11.14(A1) ; port FB_MUX_A1
SPIO_MISO: U12.1(DOUT) ; port SPI0.SPI0_MISO  [project net SPI0_MISO]
SPIO_SCLK: U12.10(SCLK) ; port SPI0.SPI0_SCLK  [project net SPI0_SCLK]
ZH_Reduced: R20.1 R21.2 U11.4(S1)
ZP_Reduced: R22.1 R23.2 U11.11(S3)
NetC25_2: C25.2 U14.1(Filter)
NetP6_1: P6.1(X) U9.1(OUT) U9.4(IN-) U12.5(AIN)
NetR24_1: R24.1 R25.2 U11.10(S4)

Not connected (* = marked no-connect by the designer): U11 7(NC)* 8(NC)* 9(NC)*

### Notes on the sheet
- (near R22) PLTU0805U1003LST5
- RNCF0805TKY10K0
- (near U11) 225mA
- CHANGE TO .01% 0402 RESISTORS
- 4.096V
- Title
- Size:
- Date:
- Tabloid
- Number:
- Time:
- Revision:
- Sheet
- of
- ZLS Corporation
- 7801 North Lamar Blvd.
- Suite E-184
- Austin, Texas 78752  USA
- (512) 453-0288
- File:

### Library data of the parts
C20 C22 C23 C25 C26 = CMP-1036-04795-1: as C2 on sheet Sheet1; Supplier 1: Digi-Key; Supplier Part Number 1: 490-1673-6-ND; RoHS: RoHS Compliant; Category: Capacitors; Stock 1: 891652; Pricing 1: 1=0.2, 10=0.145, 100=0.0683, 500=0.04788, 1000=0.03964 (USD); Packaging: Digi-Reel®; Part Status: Active; Voltage - Rated: 25V; Temperature Coefficient: X7R; Operating Temperature: -55°C ~ 125°C; Features: -; Ratings: -; Applications: General Purpose; Mounting Type: Surface Mount, MLCC; Package / Case: 0805 (2012 Metric); Size / Dimension: 0.079" L x 0.049" W (2.00mm x 1.25mm); Height - Seated (Max): -; Thickness (Max): 0.053" (1.35mm); Lead Spacing: -; Lead Style: -; ComponentLink1URL: http://www.murata.com/~/media/webrenewal/support/library/catalog/products/capacitor/mlcc/c02e.ashx; ComponentLink1Description: http://www.murata.com/~/media/webrenewal/support/library/catalog/products/capacitor/mlcc/c02e.ashx
P6 = SMB: SMB Straight Connector; LatestRevisionDate: 17-Jul-2002; LatestRevisionNote: Re-released for DXP Platform.; Publisher: Altium Limited
R20 R22 = CMP-1013-00215-1: RES SMD 100K OHM 1% 1/8W 0805; Manufacturer: Vishay Dale; Manufacturer Part Number: RCA0805100KFKEA; Power (Watts): 0.125W, 1/8W; Temperature Coefficient: ±100ppm/°C; Supplier 1: Digi-Key; Supplier Part Number 1: 541-2230-1-ND; RoHS: RoHS Compliant; Category: Resistors; Stock 1: 18704; Pricing 1: 1=0.1, 10=0.079, 100=0.0303, 1000=0.01331, 2500=0.0115 (USD); Packaging: Cut Tape (CT); Part Status: Active; Tolerance: ±1%; Composition: Thick Film; Features: Anti-Sulfur, Automotive AEC-Q200; Operating Temperature: -55°C ~ 155°C; Package / Case: 0805 (2012 Metric); Supplier Device Package: 0805; Size / Dimension: 0.079" L x 0.049" W (2.01mm x 1.25mm); Height - Seated (Max): 0.020" (0.50mm); Failure Rate: -; ComponentLink1URL: http://www.vishay.com/docs/20037/rcae3.pdf; ComponentLink1Description: http://www.vishay.com/docs/20037/rcae3.pdf
R21 R24 R25 = CMP-1013-00215-1: RES SMD 10K OHM 1% 1/8W 0805; Manufacturer: Vishay Dale; Manufacturer Part Number: CRCW080510K0FKEA; Power (Watts): 0.125W, 1/8W; Temperature Coefficient: ±100ppm/°C; Supplier 1: Digi-Key; Supplier Part Number 1: 541-10.0KCCT-ND; RoHS: RoHS Compliant; Category: Resistors; Stock 1: 1104982; Pricing 1: 1=0.1, 10=0.055, 100=0.0223, 1000=0.01003, 2500=0.0087 (USD); Packaging: Cut Tape (CT); Part Status: Active; Tolerance: ±1%; Composition: Thick Film; Features: Automotive AEC-Q200; Operating Temperature: -55°C ~ 155°C; Package / Case: 0805 (2012 Metric); Supplier Device Package: 0805; Size / Dimension: 0.079" L x 0.049" W (2.00mm x 1.25mm); Height - Seated (Max): 0.020" (0.50mm); Failure Rate: -; ComponentLink1URL: http://www.vishay.com/docs/20035/dcrcwe3.pdf; ComponentLink1Description: http://www.vishay.com/docs/20035/dcrcwe3.pdf
R23 = CMP-1013-00215-1: RES SMD 10K OHM 1% 1/8W 0805
U9 = CMP-0809-00005-2: as U7 on sheet Sheet1; PartNumber: OPA188AIDBVR; ComponentLink2Description: Datasheet; ComponentLink2URL: http://www.ti.com/lit/ds/symlink/opa188.pdf; ComponentLink1Description: Manufacturer URL; Mounting Technology: Surface Mount; Eco-Plan: Green (RoHS & no Sb/Br); ComponentLink1URL: http://www.ti.com/; PackageVersion: 4073253-4/K, 03/2006; DatasheetVersion: SBOS642A; ComponentLink3Description: Package Specification; PackageReference: DBV0005A; ComponentLink3URL: http://www.ti.com/litv/pdf/mpds018i; PackageDescription: 5-Pin Plastic Small Outline, Body 1.6 x 2.9 mm, Pitch 0.95 mm; Code_JEDEC: MO-178
U11 = CMP-0793-00109-1: Low Capacitance, Low Charge Injection, +/-15 V / +12 V, 4:1 iCMOS Multiplexer, 120 Ohm Ron, 14-pin SOP (RU-14), Reel; Manufacturer: Maxim Integrated; Manufacturer Part Number: MAX11100EUB+; Number of Bits: 16; Sampling Rate (Per Second): 200k; Number of Inputs: 1; Input Type: Single Ended; Data Interface: SPI; Configuration: S/H-ADC; Ratio - S/H:ADC: 1:1; Architecture: SAR; Reference Type: External; Voltage - Supply, Analog: 5V; Voltage - Supply, Digital: 2.7 V ~ 5.25 V; Supplier 1: Digi-Key; Supplier Part Number 1: MAX11100EUB+-ND; RoHS: RoHS Compliant; Category: Integrated Circuits (ICs); Stock 1: 927; Pricing 1: 1=5.98, 10=5.855 (USD); Packaging: Tube; Part Status: Active; Features: -; Operating Temperature: -40°C ~ 85°C; Package / Case: 10-TFSOP, 10-MSOP (0.118", 3.00mm Width); Supplier Device Package: 10-uMAX; Base Part Number: MAX11100; ComponentLink1URL: https://datasheets.maximintegrated.com/en/ds/MAX11100.pdf; ComponentLink1Description: https://datasheets.maximintegrated.com/en/ds/MAX11100.pdf
U12 = CMP-0249-00017-1: 16-Bit, +5V, 200ksps ADC with 10uA Shutdown, 10-Pin uMAX, -40°C to +85°C, Pb-Free, Tape and Reel; Manufacturer: Maxim Integrated; Number of Bits: 16; Sampling Rate (Per Second): 200k; Number of Inputs: 1; Input Type: Single Ended; Data Interface: SPI; Configuration: S/H-ADC; Ratio - S/H:ADC: 1:1; Architecture: SAR; Reference Type: External; Voltage - Supply, Analog: 5V; Voltage - Supply, Digital: 2.7 V ~ 5.25 V; Supplier 1: Digi-Key; Supplier Part Number 1: MAX11100EUB+-ND; Manufacturer Part Number: MAX11100EUB+; RoHS: RoHS Compliant; Category: Integrated Circuits (ICs); Stock 1: 927; Pricing 1: 1=5.98, 10=5.855 (USD); Packaging: Tube; Part Status: Active; Features: -; Operating Temperature: -40°C ~ 85°C; Package / Case: 10-TFSOP, 10-MSOP (0.118", 3.00mm Width); Supplier Device Package: 10-uMAX; Base Part Number: MAX11100; ComponentLink1URL: https://datasheets.maximintegrated.com/en/ds/MAX11100.pdf; ComponentLink1Description: https://datasheets.maximintegrated.com/en/ds/MAX11100.pdf
U14 = MAX6070AAUT41+T: IC VREF SERIES 4.096V SOT23; Manufacturer: Maxim Integrated; Output Type: Fixed; Tolerance: ±0.04%; Temperature Coefficient: 6ppm/°C; Noise - 0.1Hz to 10Hz: 9.6µVp-p; Noise - 10Hz to 10kHz: 9µVrms; Voltage - Input: 4.3 V ~ 5.5 V; Current - Supply: 350µA; Supplier 1: Digi-Key; Manufacturer Part Number: MAX6070AAUT41+T; RoHS: RoHS Compliant; Category: Integrated Circuits (ICs); Stock 1: 2623; Pricing 1: 1=3.41, 10=3.213, 25=2.5704, 50=2.4418, 100=2.2491, 250=2.13344, 500=2.05634 (USD); Packaging: Cut Tape (CT); Part Status: Active; Reference Type: Series; Voltage - Output (Min/Fixed): 4.096V; Operating Temperature: -40°C ~ 125°C (TA); Mounting Type: Surface Mount; Package / Case: SOT-23-6; Supplier Device Package: SOT-23-6; ComponentLink1URL: https://datasheets.maximintegrated.com/en/ds/MAX6070-MAX6071.pdf; ComponentLink1Description: https://datasheets.maximintegrated.com/en/ds/MAX6070-MAX6071.pdf

## Nets that join several sheets
+3.3: Sheet1 (C10.1 P3.6 P4.25 U5.5), Sheet2 (C23.1 U12.3)
+5: Sheet1 (6 pins), Sheet2 (8 pins)
+5R: Sheet1 (U4.12 U4.17 U7.1 U7.4), Sheet2 (R24.2)
AGND: Sheet1 (33 pins), Sheet2 (12 pins)
GND: Sheet1 (18 pins), Sheet2 (C23.2 C26.2 R21.1 U12.2)
ZH: Sheet1 (C8.1 P2.8 TP5.1 U3.1), Sheet2 (R20.2)
ZP: Sheet1 (5 pins), Sheet2 (R22.2)
Beam Sync Demod Filter Out: Sheet1 (C24.2 P5.1 R29.1), Sheet2 (U11.5)
FB_CS0: Sheet1 (P4.6), Sheet2 (U12.9)
FB_MUX_A0: Sheet1 (P3.27), Sheet2 (U11.1)
FB_MUX_A1: Sheet1 (P3.25), Sheet2 (U11.14)
SPI0_MISO: Sheet1 (P4.11), Sheet2 (U12.1)
SPI0_SCLK: Sheet1 (P4.13), Sheet2 (U12.10)